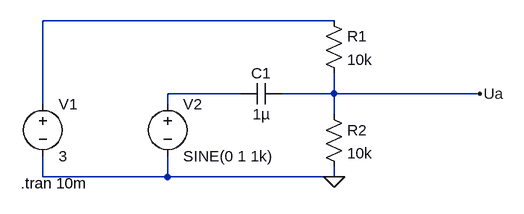
[diagram p0: schematic DC-ofs.asc]
DC-ofs.asc, the LTspice schematic file:
Version 4
SHEET 1 880 680
WIRE 544 0 96 0
WIRE 400 112 288 112
WIRE 544 112 544 80
WIRE 544 112 464 112
WIRE 768 112 544 112
WIRE 96 128 96 0
WIRE 288 128 288 112
WIRE 544 144 544 112
WIRE 96 240 96 208
WIRE 288 240 288 208
WIRE 288 240 96 240
WIRE 544 240 544 224
WIRE 544 240 288 240
FLAG 768 112 Ua
FLAG 544 240 0
SYMBOL voltage 96 112 R0
WINDOW 123 0 0 Left 0
WINDOW 39 0 0 Left 0
SYMATTR InstName V1
SYMATTR Value 3
SYMBOL voltage 288 112 R0
WINDOW 123 0 0 Left 0
WINDOW 39 0 0 Left 0
SYMATTR InstName V2
SYMATTR Value SINE(0 1 1k)
SYMBOL res 528 -16 R0
SYMATTR InstName R1
SYMATTR Value 10k
SYMBOL res 528 128 R0
SYMATTR InstName R2
SYMATTR Value 10k
SYMBOL cap 464 96 R90
WINDOW 0 0 32 VBottom 2
WINDOW 3 32 32 VTop 2
SYMATTR InstName C1
SYMATTR Value 1µ
TEXT 62 250 Left 2 !.tran 10m

The netlist it stands for:
* DC-ofs.asc
V1 N001 0 3
V2 N002 0 SINE(0 1 1k)
R1 N001 Ua 10k
R2 Ua 0 10k
C1 Ua N002 1µ
.tran 10m
.backanno
.end